# EAGLE design power (EAGLE 9.2.2)
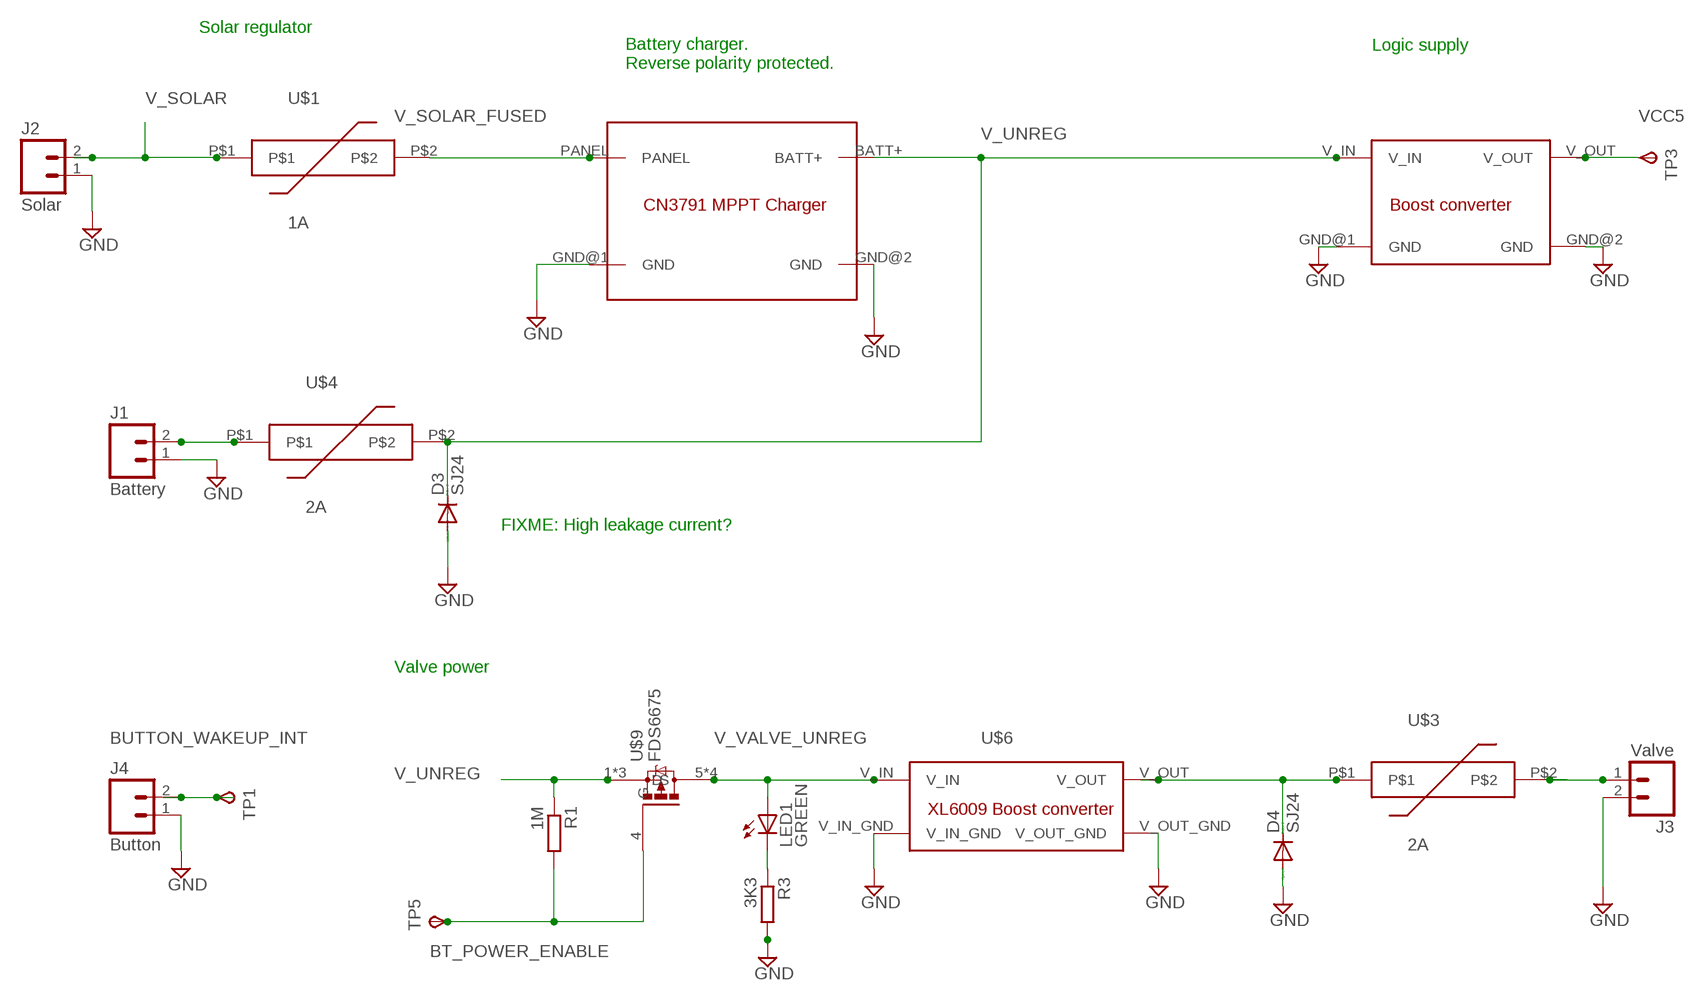
[diagram p0: schematic, sheet 1]

## Parts
D3  SJ24  DIODE-SMB  [SMB]
D4  SJ24  DIODE-SMB  [SMB]
J1  Battery  M02PTH3  [1X02_LONGPADS]
J2  Solar  M02PTH3  [1X02_LONGPADS]
J3  Valve  M02PTH3  [1X02_LONGPADS]
J4  Button  M02PTH3  [1X02_LONGPADS]
LED1  GREEN  LED3MM  [LED3MM]
R1  1M  R-EU_R0805  [R0805]
R3  3K3  R-EU_R0805  [R0805]
TP1  TPSB1,27  [B1,27]
TP3  TPSB1,27  [B1,27]
TP5  TPSB1,27  [B1,27]
U$1  1A  PTC  [1812]
U$2  CN3791_MTTP_LIPO_SOLAR_CHARGER  [CN3791_MPPT_LIPO_SOLAR_CHARGER]
U$3  2A  PTC  [1812]
U$4  2A  PTC  [1812]
U$5  QSKJ_BOOST_MODULE  [QSKJ_BOOST_MODULE]
U$6  XL6009_BOOST_MODULE  [XL6009_BOOST_MODULE]
U$9  FDS6675  [SO08]

## Nets
BT_POWER_ENABLE: R1.2 TP5.TP(PP) U$9.4(G)
BUTTON_WAKEUP_INT: J4.2 TP1.TP(PP)
GND: D3.A D4.A J1.1 J2.1 J3.2 J4.1 R3.2 U$2.GND@1(GND) U$2.GND@2(GND) U$5.GND@1(GND) U$5.GND@2(GND) U$6.V_IN_GND U$6.V_OUT_GND
N$3: J1.2 U$4.P$1
N$6: D4.C U$3.P$1 U$6.V_OUT
N$9: LED1.K(C) R3.1
V_SOLAR: J2.2 U$1.P$1
V_SOLAR_FUSED: U$1.P$2 U$2.PANEL
V_UNREG: D3.C R1.1 U$2.BATT+ U$4.P$2 U$5.V_IN U$9.1(S) U$9.2(S) U$9.3(S)
V_VALVE_UNREG: LED1.A U$6.V_IN U$9.5(D) U$9.6(D) U$9.7(D) U$9.8(D)
VALVE: J3.1 U$3.P$2
VCC5: TP3.TP(PP) U$5.V_OUT

## Notes on the sheet
- Solar regulator
- Logic supply
- Battery charger.
  Reverse polarity protected.
- FIXME: High leakage current?
- Valve power

## Library data of the parts
D3 D4 = diode:DIODE-: DIODE
J1-J4 = SparkFun-Connectors:M02: Standard 2-pin 0.1" header. Use with - straight break away headers ( PRT-00116) - right angle break away headers (PRT-00553) - swiss pins (PRT-00743) - machine pins (PRT-00117) - female headers (PRT-00115) Molex polarized connector foot print use with: PRT-08233 with associated crimp pins and housings. 2.54_SCREWTERM for use with PRT-10571. 3.5mm Screw Terminal footprints for PRT-08084 5mm Screw Terminal footprints for use with PRT-08432
LED1 = led:LED: LED OSRAM: - CHIPLED LG R971, LG N971, LY N971, LG Q971, LY Q971, LO R971, LY R971 LH N974, LH R974 LS Q976, LO Q976, LY Q976 LO Q996 - Hyper CHIPLED LW Q18S LB Q993, LB Q99A, LB R99A - SideLED LS A670, LO A670, LY A670, LG A670, LP A670 LB A673, LV A673, LT A673, LW A673 LH A674 LY A675 LS A676, LA A676, LO A676, LY A676, LW A676 LS A679, LY A679, LG A679 - Hyper Micro SIDELED® LS Y876, LA Y876, LO Y876, LY Y876 LT Y87S - SmartLED LW L88C, LW L88S LB L89C, LB L89S, LG L890 LS L89K, LO L89K, LY L89K LS L896, LA L896, LO L896, LY L896 - TOPLED LS T670, LO T670, LY T670, LG T670, LP T670 LSG T670, LSP T670, LSY T670, LOP T670, LYG T670 LG T671, LOG T671, LSG T671 LB T673, LV T673, LT T673, LW T673 LH T674 LS T676, LA T676, LO T676, LY T676, LB T676, LH T676, LSB T676, LW T676 LB T67C, LV T67C, LT T67C, LS T67K, LO T67K, LY T67K, LW E67C LS E67B, LA E67B, LO E67B, LY E67B, LB E67C, LV E67C, LT E67C LW T67C LS T679, LY T679, LG T679 LS T770, LO T770, LY T770, LG T770, LP T770 LB T773, LV T773, LT T773, LW T773 LH T774 LS E675, LA E675, LY E675, LS T675 LS T776, LA T776, LO T776, LY T776, LB T776 LHGB T686 LT T68C, LB T68C - Hyper Mini TOPLED® LB M676 - Mini TOPLED Santana® LG M470 LS M47K, LO M47K, LY M47K Source: http://www.osram.convergy.de LUXEON: - LUMILED® LXK2-PW12-R00, LXK2-PW12-S00, LXK2-PW14-U00, LXK2-PW14-V00 LXK2-PM12-R00, LXK2-PM12-S00, LXK2-PM14-U00 LXK2-PE12-Q00, LXK2-PE12-R00, LXK2-PE12-S00, LXK2-PE14-T00, LXK2-PE14-U00 LXK2-PB12-K00, LXK2-PB12-L00, LXK2-PB12-M00, LXK2-PB14-N00, LXK2-PB14-P00, LXK2-PB14-Q00 LXK2-PR12-L00, LXK2-PR12-M00, LXK2-PR14-Q00, LXK2-PR14-R00 LXK2-PD12-Q00, LXK2-PD12-R00, LXK2-PD12-S00 LXK2-PH12-R00, LXK2-PH12-S00 LXK2-PL12-P00, LXK2-PL12-Q00, LXK2-PL12-R00 Source: www.luxeon.com KINGBRIGHT: KA-3528ASYC Source: www.kingbright.com
R1 R3 = resistor:R-EU_: RESISTOR, European symbol
TP1 TP3 TP5 = testpad:TPS: TEST PIN
U$1 U$3 U$4 = Semiconductors:PTC: PTC polyfuse
U$2 = breakout-modules:CN3791_MTTP_LIPO_SOLAR_CHARGER: CN3791 MPPT Solar charger module For single cell LIPO battery. Max 25V input.
U$5 = breakout-modules:QSKJ_BOOST_MODULE: QSKJ Boost module Input 2.5-6V Output 5V 1A Switching frequency 1MHz Output ripple 20mV Voltage Regulation ± 2.5%
U$6 = breakout-modules:XL6009_BOOST_MODULE: XL6009 Boost converter Vin: 3-35V, 4A Vout: 5-35V, 2A Quiescent current: 18mA Switching frequency: 400KHz Ripple: 50mV Voltage regulation: 0.5% Size: 43 x 22 x 16mm
U$9 = Semiconductors:FDS6675: Single P-Channel, Logic Level, PowerTrenchTM MOSFET. FDS6675 -11 A, -30 V. RDS(ON) = 0.014 @ VGS = -10 V, RDS(ON) = 0.020 @ VGS = -4.5 V. Gate Threshold Voltage: 1.7 V https://www.fairchildsemi.com/datasheets/FD/FDS6675.pdf

## Board
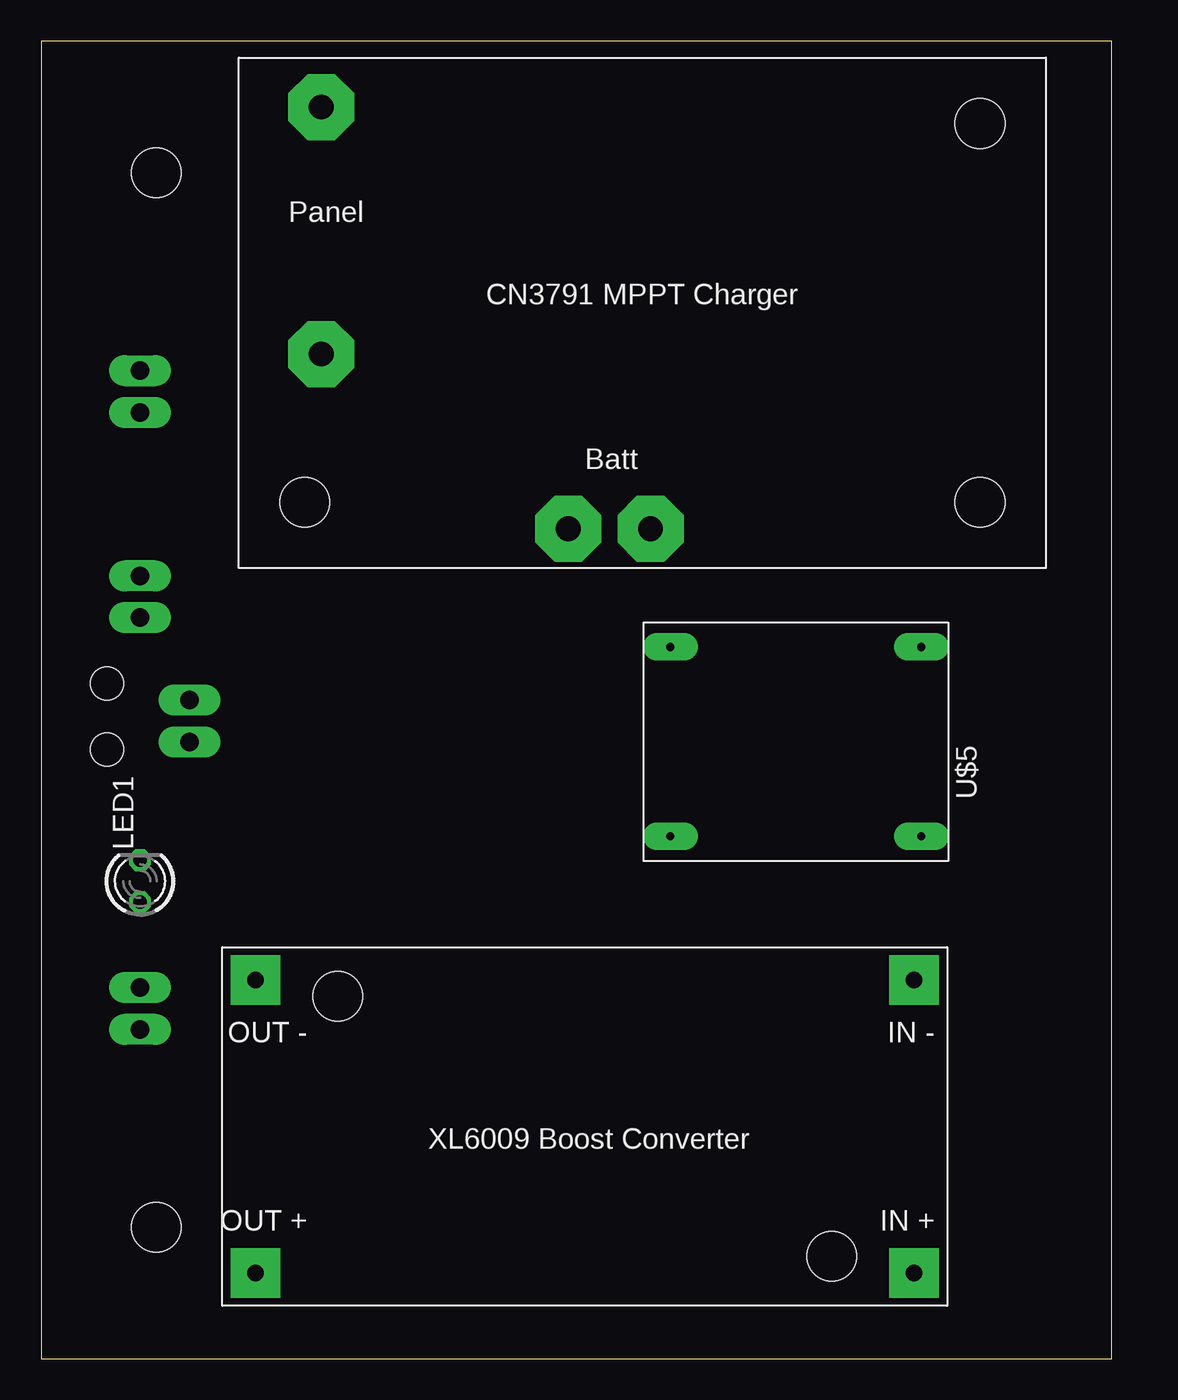
[diagram p1: board, top side]
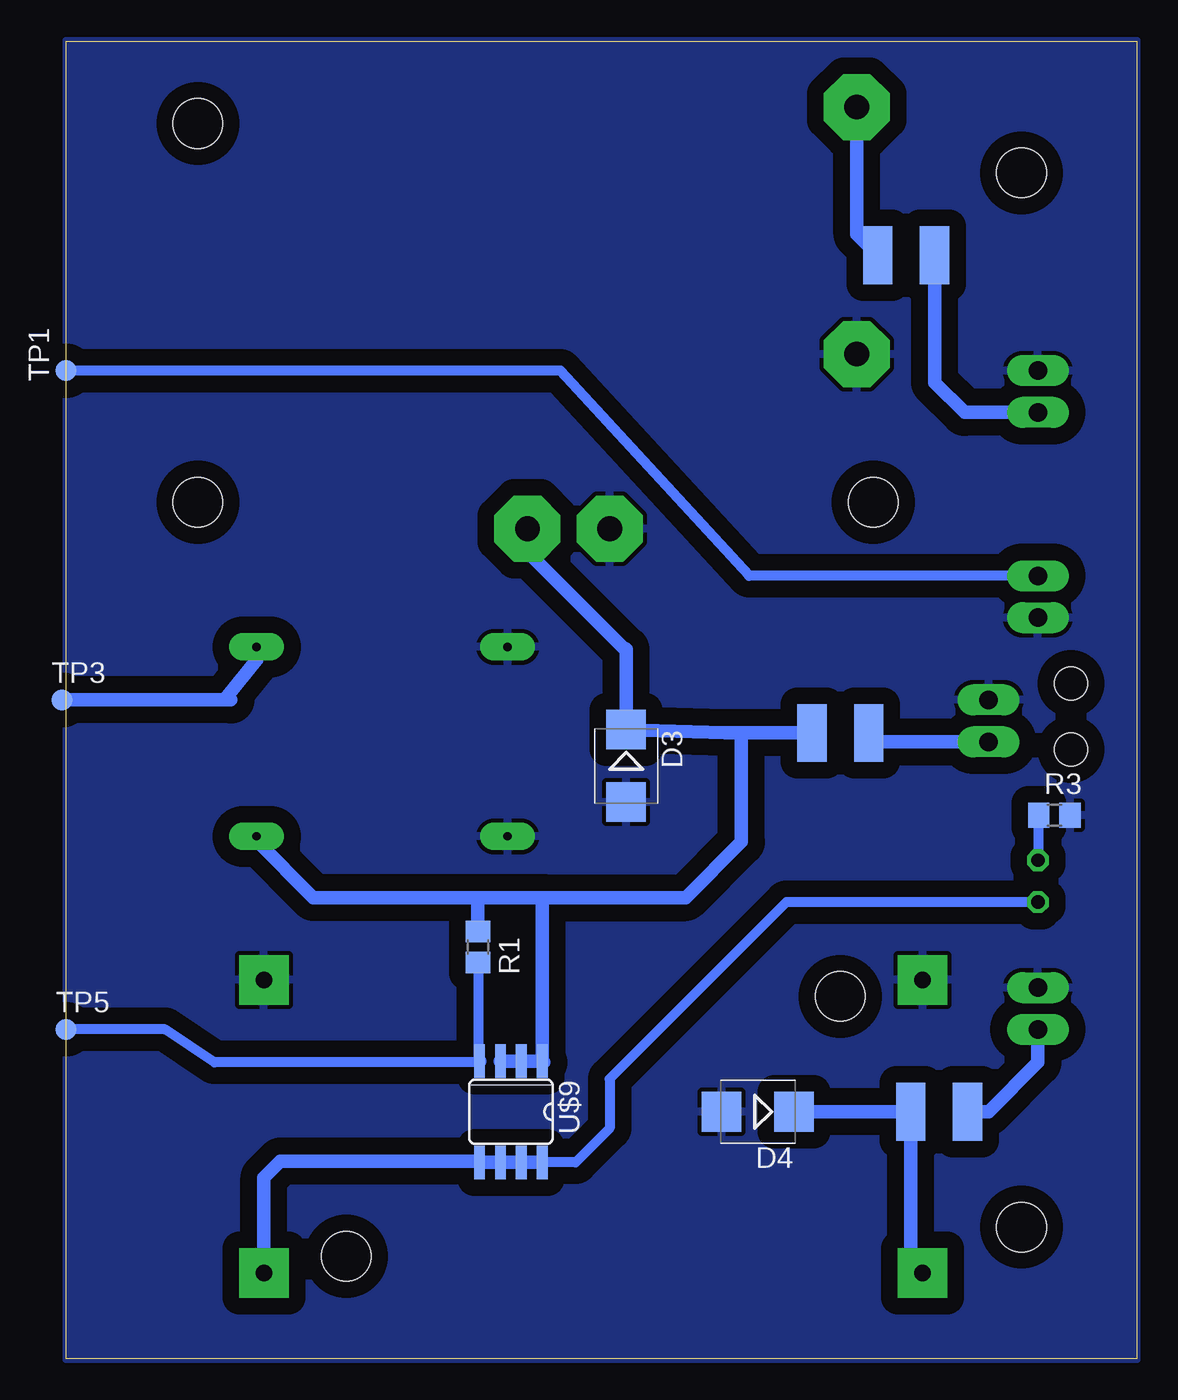
[diagram p2: board, bottom side, seen from below]

Size 65 x 80 mm. Coordinates in mm from the lower left corner, seen from the top.
Outline: 0,0 65,0 65,80 0,80 0,0
Copper layers (1*16): Top 0.035mm / dielectric 1.5mm / Bottom 0.035mm
Design rules "default *": minimum track width 12mil, minimum drill 0.35mm, track to track 6mil, track to pad 6mil, pad to pad 6mil, via to via 6mil, smd to smd 6mil, copper to edge 0mil, drill to drill 6mil, minimum pad ring 10mil, minimum via ring 8mil, stop-mask expansion 4mil, vias tented up to drill 0mil, thermal gap 10mil
Holes 3 mm at 7,72 7,8
Holes 2 mm at 4,41 4,37

### Footprints (pad centres in the part's own frame; a part is rotated, then mirrored left to right if it is on the bottom)
SMB = smd 2.4 x 2.4: A 2.2,0; C -2.2,0
1X02_LONGPADS = drill 1.118 pad 1.88 long: 1 0,0; 2 2.54,0
LED3MM = drill 0.813 octagon: A -1.27,0; K 1.27,0
R0805 = smd 1.3 x 1.5: 1 -0.95,0; 2 0.95,0
B1,27 = smd 1.27 x 1.27: TP 0,0
1812 = smd 3.5 x 1.78: P$1 0,1.725; P$2 0,-1.725
CN3791_MPPT_LIPO_SOLAR_CHARGER = drill 1.5 pad 4 octagon: BATT+ 25,2.4; GND@1 5,13; GND@2 20,2.4; PANEL 5,28 | hole 3: 4,4; 45,4; 45,27
QSKJ_BOOST_MODULE = drill 0.5 pad 1.676 long: GND@1 -5.75,7.62; GND@2 5.75,7.62; V_IN -5.75,-7.62; V_OUT 5.75,-7.62
XL6009_BOOST_MODULE = drill 1 pad 3 square: V_IN 0,17.78; V_IN_GND 0,0; V_OUT 40,17.78; V_OUT_GND 40,0 | hole 3: 5,16.78; 35,1
SO08 = smd 0.66 x 2.032: 1 -1.905,-3.073; 2 -0.635,-3.073; 3 0.635,-3.073; 4 1.905,-3.073; 5 1.905,3.073; 6 0.635,3.073; 7 -0.635,3.073; 8 -1.905,3.073

### Placement (x,y rotation side)
D3  31,36 270 bottom
D4  23,15 180 bottom
J1  9,40 270 top
J2  6,60 270 top
J3  6,20 90 top
J4  6,45 90 top
LED1  6,29 90 top
R1  40,25 270 bottom
R3  5,33 0 bottom
TP1  65,60 90 bottom
TP3  65.25,40 0 bottom
TP5  65,20 0 bottom
U$1  14,67 270 bottom
U$2  12,48 0 top
U$3  12,15 90 bottom
U$4  18,38 270 bottom
U$5  45.82,37.47 90 top
U$6  53,23 180 top
U$9  38,15 180 bottom

### Tracks (layer width: path | path; a pad name or v marks a point on that pad's centre or on a via)
BT_POWER_ENABLE
  Bottom 0.61: TP5.TP 59,20 56,18 39.98,18 39.98,24.03
  Bottom 0.813: U$9.4 39.98,18 | R1.2 39.98,24.03
BUTTON_WAKEUP_INT
  Bottom 0.61: J4.2 23.54,47.54 35,60 TP1.TP
GND
  pour Bottom (isolate 1.016): 0,80 65,80 65,0 0,0
N$3
  Bottom 0.813: U$4.P$1 15.73,37.46 J1.2
N$6
  Bottom 0.813: U$6.V_OUT 13.72,5.95 U$3.P$1 D4.C
N$9
  Bottom 0.61: LED1.K 5.95,30.22 R3.1
V_SOLAR
  Bottom 0.813: J2.2 10.46,57.46 12.28,59.27 U$1.P$1
V_SOLAR_FUSED
  Bottom 0.813: 15.85,66.88 U$1.P$2 17,68.28 U$2.PANEL
V_UNREG
  Bottom 0.813: 36,28 27.39,28 24,31.39 24,38 | 36,28 40,28 | U$9.1 U$9.2 U$9.3 | 36,18 36.07,18.07 U$9.1 | U$9.1 36.09,27.91 36,28 | R1.1 40,28 | U$4.P$2 24,38 | 24,38 25,38 D3.C 31,43.07 31.18,43.18 37,49 U$2.BATT+ | 40,28 50,28 53.44,31.44 U$5.V_IN
V_VALVE_UNREG
  Bottom 0.61: LED1.A 21.27,27.73 32,17 32,14 34.07,11.93 U$9.8
  Bottom 0.813: U$9.8 U$9.7 U$9.6 U$9.5 39.98,12 52,12 53,11 U$6.V_IN
VALVE
  Bottom 0.813: U$3.P$2 9,15 6,18 J3.1
VCC5
  Bottom 0.813: U$5.V_OUT 53.44,42.45 55.22,40.22 55,40 TP3.TP